# Altium project new_top.PrjPCB
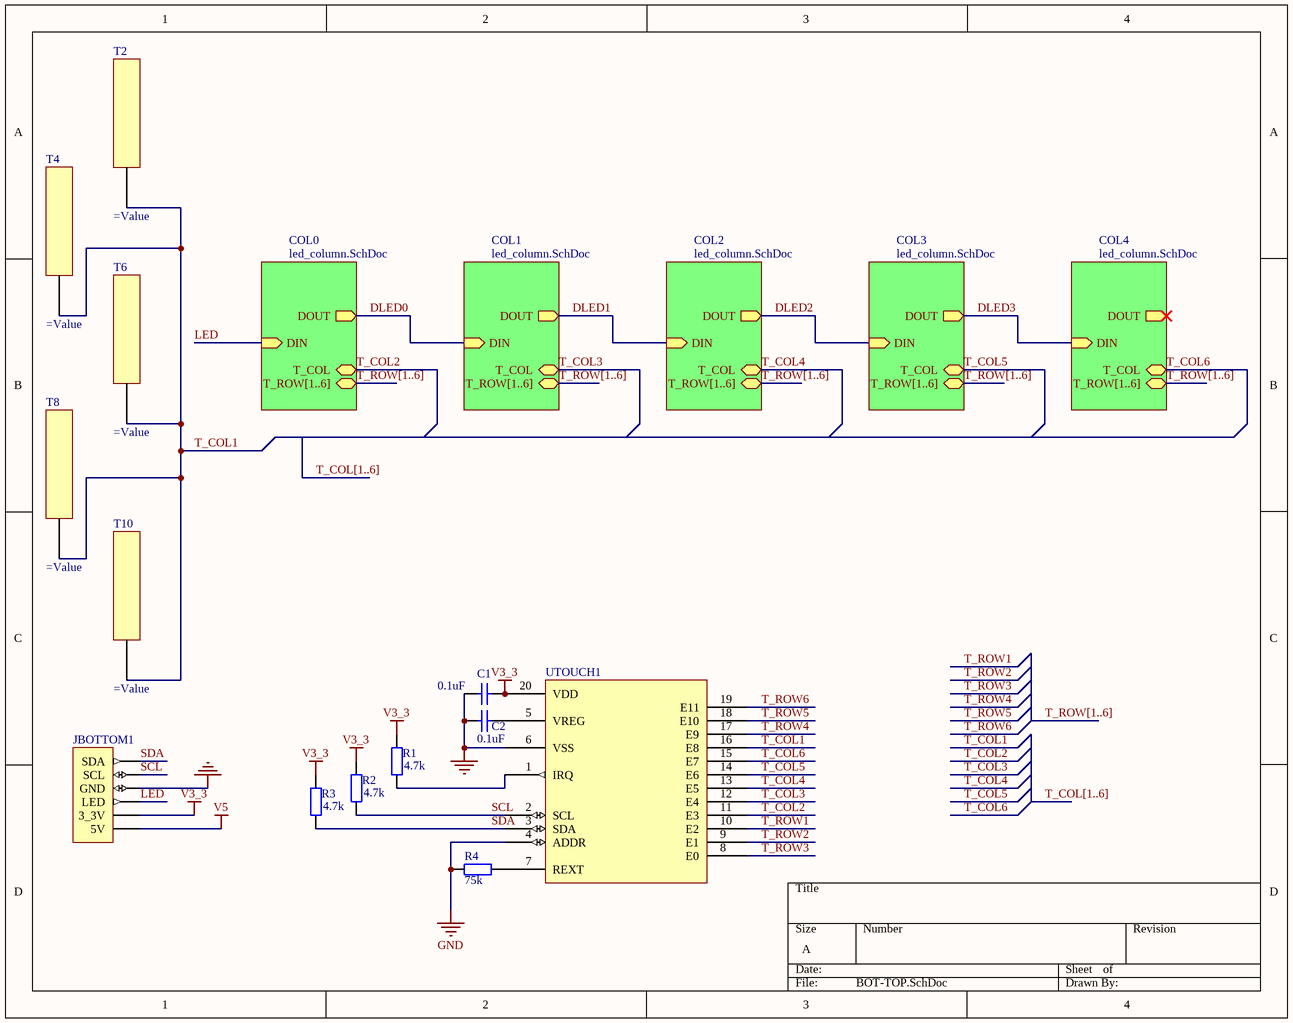
[diagram p0: BOT-TOP.SchDoc]
2 sheets, 118 parts. Net scope: hierarchical (ports join the sheet entries above them; power ports are global).
Board file: bot_top_4.PcbDoc
Sheets:
  BOT-TOP.SchDoc
    COL0 = led_column.SchDoc
    COL1 = led_column.SchDoc
    COL2 = led_column.SchDoc
    COL3 = led_column.SchDoc
    COL4 = led_column.SchDoc

## Sheet BOT-TOP.SchDoc
size A

### Parts
C1  0.1uF  [CAPC2012L]
C2  0.1uF  [CAPC2012L]
JBOTTOM1  (no value)  [HDR1X6]
R1  4.7k  [RESC2012L]
R2  4.7k  [RESC2012L]
R3  4.7k  [RESC2012L]
R4  75k  [RESC2012L]
T2  (no value)  [TouchStrip_Vert]
T4  (no value)  [TouchStrip_Vert]
T6  (no value)  [TouchStrip_Vert]
T8  (no value)  [TouchStrip_Vert]
T10  (no value)  [TouchStrip_Vert]
UTOUCH1  (no value)  [MPR121]

### Sub-sheets
COL0 = led_column.SchDoc: DOUT (out), DIN (in), T_COL (bidir), T_ROW[1..6] (bidir)
COL1 = led_column.SchDoc: DOUT (out), DIN (in), T_COL (bidir), T_ROW[1..6] (bidir)
COL2 = led_column.SchDoc: DOUT (out), DIN (in), T_COL (bidir), T_ROW[1..6] (bidir)
COL3 = led_column.SchDoc: DOUT (out), DIN (in), T_COL (bidir), T_ROW[1..6] (bidir)
COL4 = led_column.SchDoc: DOUT (out), DIN (in), T_COL (bidir), T_ROW[1..6] (bidir)

### Nets
GND: C1.1 C2.1 JBOTTOM1.4(GND) R4.1 UTOUCH1.4(ADDR) UTOUCH1.6(VSS)
V3_3: C1.2 JBOTTOM1.2(3_3V) R1.1 R2.1 R3.1 UTOUCH1.20(VDD)
V5: JBOTTOM1.1(5V)
DLED0: sheet COL0/DOUT, sheet COL1/DIN
DLED1: sheet COL1/DOUT, sheet COL2/DIN
DLED2: sheet COL2/DOUT, sheet COL3/DIN
DLED3: sheet COL3/DOUT, sheet COL4/DIN
LED: JBOTTOM1.3(LED) ; sheet COL0/DIN
SCL: JBOTTOM1.5(SCL) R2.2 UTOUCH1.2(SCL)
SDA: JBOTTOM1.6(SDA) R3.2 UTOUCH1.3(SDA)
T_COL1: T2.0 T4.0 T6.0 T8.0 T10.0 UTOUCH1.16(E8)
T_COL2: UTOUCH1.11(E3) ; sheet COL0/T_COL
T_COL3: UTOUCH1.12(E4) ; sheet COL1/T_COL
T_COL4: UTOUCH1.13(E5) ; sheet COL2/T_COL
T_COL5: UTOUCH1.14(E6) ; sheet COL3/T_COL
T_COL6: UTOUCH1.15(E7) ; sheet COL4/T_COL
T_ROW1: UTOUCH1.10(E2)
T_ROW2: UTOUCH1.9(E1)
T_ROW3: UTOUCH1.8(E0)
T_ROW4: UTOUCH1.17(E9)
T_ROW5: UTOUCH1.18(E10)
T_ROW6: UTOUCH1.19(E11)
NetC2_2: C2.2 UTOUCH1.5(VREG)
NetR1_2: R1.2 UTOUCH1.1(IRQ)
NetR4_2: R4.2 UTOUCH1.7(REXT)

### Buses and harness runs
bus T_COL[1..6]
bus T_ROW[1..6]
bus T_ROW[1..6] = sheet COL0/T_ROW[1..6]
bus T_ROW[1..6] = sheet COL1/T_ROW[1..6]
bus T_ROW[1..6] = sheet COL2/T_ROW[1..6]
bus T_ROW[1..6] = sheet COL3/T_ROW[1..6]
bus T_ROW[1..6] = sheet COL4/T_ROW[1..6]

### Library data of the parts
C1 C2 = Cap: Capacitor; Published: 8-Jun-2000; LatestRevisionDate: 17-Jul-2002; LatestRevisionNote: Re-released for DXP Platform.; PackageReference: RAD-0.3; Publisher: Altium Limited; PackageDescription: Radial Cap, Thru-Hole; 2 Leads; 0.3 in Pin Spacing; Value: 0.1uF
JBOTTOM1 = Header 6: Header, 6-Pin; LatestRevisionDate: 17-Jul-2002; LatestRevisionNote: Re-released for DXP Platform.; Publisher: Altium Limited
R1-R4 = Res2: Resistor; Published: 8-Jun-2000; LatestRevisionDate: 17-Jul-2002; LatestRevisionNote: Re-released for DXP Platform.; PackageReference: AXIAL-0.4; Publisher: Altium Limited
  R1-R3: Value: 4.7k
  R4: Value: 75k
T2 T4 T6 T8 T10 = TouchStrip
UTOUCH1 = MPR121

## Sheet led_column.SchDoc
size A
Used 5 times, as channels COL0, COL1, COL2, COL3, COL4. Parts and nets are listed once, with the designators drawn on the sheet.
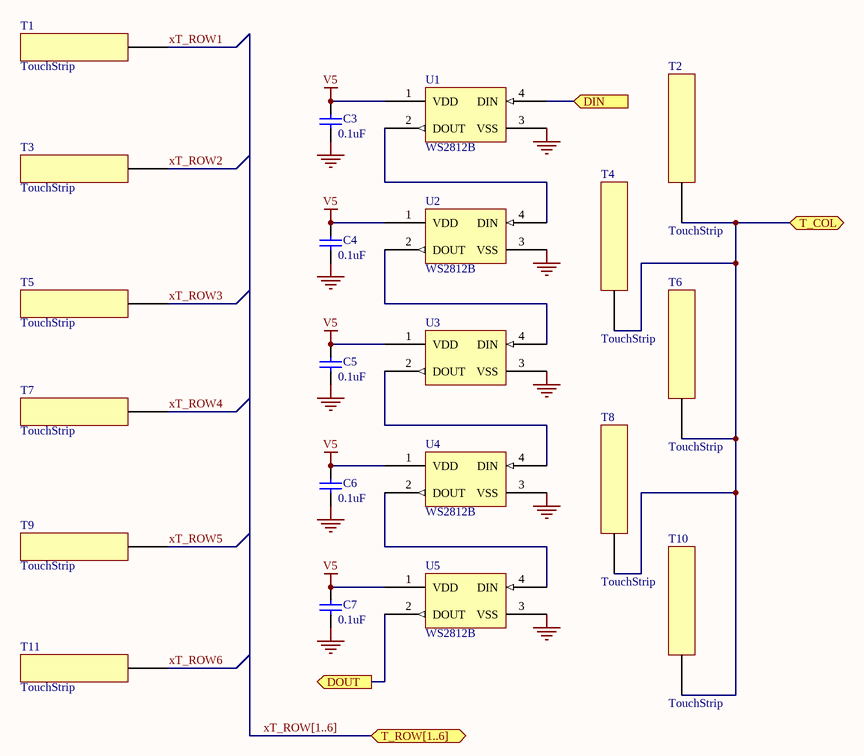
[diagram p1: led_column.SchDoc]

### Parts
C3  0.1uF  [CAPC2012L]
C4  0.1uF  [CAPC2012L]
C5  0.1uF  [CAPC2012L]
C6  0.1uF  [CAPC2012L]
C7  0.1uF  [CAPC2012L]
T1  TouchStrip  [TouchStrip]
T2  TouchStrip  [TouchStrip]
T3  TouchStrip  [TouchStrip]
T4  TouchStrip  [TouchStrip]
T5  TouchStrip  [TouchStrip]
T6  TouchStrip  [TouchStrip]
T7  TouchStrip  [TouchStrip]
T8  TouchStrip  [TouchStrip]
T9  TouchStrip  [TouchStrip]
T10  TouchStrip  [TouchStrip]
T11  TouchStrip  [TouchStrip]
U1  WS2812B  [WS2812B]
U2  WS2812B  [WS2812B]
U3  (no value)  [WS2812B]
U4  WS2812B  [WS2812B]
U5  WS2812B  [WS2812B]

### Ports
DIN (in), DOUT (out), T_COL (bidir), T_ROW[1..6] (bidir)

### Nets
GND: C3.2 C4.2 C5.2 C6.2 C7.2 U1.3(VSS) U2.3(VSS) U3.3(VSS) U4.3(VSS) U5.3(VSS)
V5: C3.1 C4.1 C5.1 C6.1 C7.1 U1.1(VDD) U2.1(VDD) U3.1(VDD) U4.1(VDD) U5.1(VDD)
DIN: U1.4(DIN) ; port DIN
DOUT: U5.2(DOUT) ; port DOUT
T_COL: T2.0 T4.0 T6.0 T8.0 T10.0 ; port T_COL
xT_ROW1: T1.0
xT_ROW2: T3.0
xT_ROW3: T5.0
xT_ROW4: T7.0
xT_ROW5: T9.0
xT_ROW6: T11.0
NetU1_2: U1.2(DOUT) U2.4(DIN)
NetU2_2: U2.2(DOUT) U3.4(DIN)
NetU3_2: U3.2(DOUT) U4.4(DIN)
NetU4_2: U4.2(DOUT) U5.4(DIN)

### Channels
COL0: designators end in _COL0; ports DIN=LED DOUT=DLED0 T_COL=T_COL2
COL1: designators end in _COL1; ports DIN=DLED0 DOUT=DLED1 T_COL=T_COL3
COL2: designators end in _COL2; ports DIN=DLED1 DOUT=DLED2 T_COL=T_COL4
COL3: designators end in _COL3; ports DIN=DLED2 DOUT=DLED3 T_COL=T_COL5
COL4: designators end in _COL4; ports DIN=DLED3 DOUT=NetU5_COL4_2 T_COL=T_COL6

### Buses and harness runs
bus xT_ROW[1..6] = port T_ROW[1..6]

### Library data of the parts
C3-C7 = Cap: Capacitor; Published: 8-Jun-2000; LatestRevisionDate: 17-Jul-2002; LatestRevisionNote: Re-released for DXP Platform.; PackageReference: RAD-0.3; Publisher: Altium Limited; PackageDescription: Radial Cap, Thru-Hole; 2 Leads; 0.3 in Pin Spacing; Value: 0.1uF
U3 = WS2812B

## Nets that join several sheets
GND: BOT-TOP (6 pins), COL0 (10 pins), COL1 (10 pins), COL2 (10 pins), COL3 (10 pins), COL4 (10 pins)
V5: BOT-TOP (JBOTTOM1.1), COL0 (10 pins), COL1 (10 pins), COL2 (10 pins), COL3 (10 pins), COL4 (10 pins)
DLED0: COL0 (U5_COL0.2), COL1 (U1_COL1.4)
DLED1: COL1 (U5_COL1.2), COL2 (U1_COL2.4)
DLED2: COL2 (U5_COL2.2), COL3 (U1_COL3.4)
DLED3: COL3 (U5_COL3.2), COL4 (U1_COL4.4)
LED: BOT-TOP (JBOTTOM1.3), COL0 (U1_COL0.4)
T_COL2: BOT-TOP (UTOUCH1.11), COL0 (5 pins)
T_COL3: BOT-TOP (UTOUCH1.12), COL1 (5 pins)
T_COL4: BOT-TOP (UTOUCH1.13), COL2 (5 pins)
T_COL5: BOT-TOP (UTOUCH1.14), COL3 (5 pins)
T_COL6: BOT-TOP (UTOUCH1.15), COL4 (5 pins)
T_ROW1: BOT-TOP (UTOUCH1.10), COL0 (T1_COL0.0), COL1 (T1_COL1.0), COL2 (T1_COL2.0), COL3 (T1_COL3.0), COL4 (T1_COL4.0)
T_ROW2: BOT-TOP (UTOUCH1.9), COL0 (T3_COL0.0), COL1 (T3_COL1.0), COL2 (T3_COL2.0), COL3 (T3_COL3.0), COL4 (T3_COL4.0)
T_ROW3: BOT-TOP (UTOUCH1.8), COL0 (T5_COL0.0), COL1 (T5_COL1.0), COL2 (T5_COL2.0), COL3 (T5_COL3.0), COL4 (T5_COL4.0)
T_ROW4: BOT-TOP (UTOUCH1.17), COL0 (T7_COL0.0), COL1 (T7_COL1.0), COL2 (T7_COL2.0), COL3 (T7_COL3.0), COL4 (T7_COL4.0)
T_ROW5: BOT-TOP (UTOUCH1.18), COL0 (T9_COL0.0), COL1 (T9_COL1.0), COL2 (T9_COL2.0), COL3 (T9_COL3.0), COL4 (T9_COL4.0)
T_ROW6: BOT-TOP (UTOUCH1.19), COL0 (T11_COL0.0), COL1 (T11_COL1.0), COL2 (T11_COL2.0), COL3 (T11_COL3.0), COL4 (T11_COL4.0)